# EAGLE design switch (EAGLE 8.2.2)
CNAME: Simulacare; CREVISION: 1.0.1; DESIGNER: Rinaldo; UNTITLED: Chaves Compressão
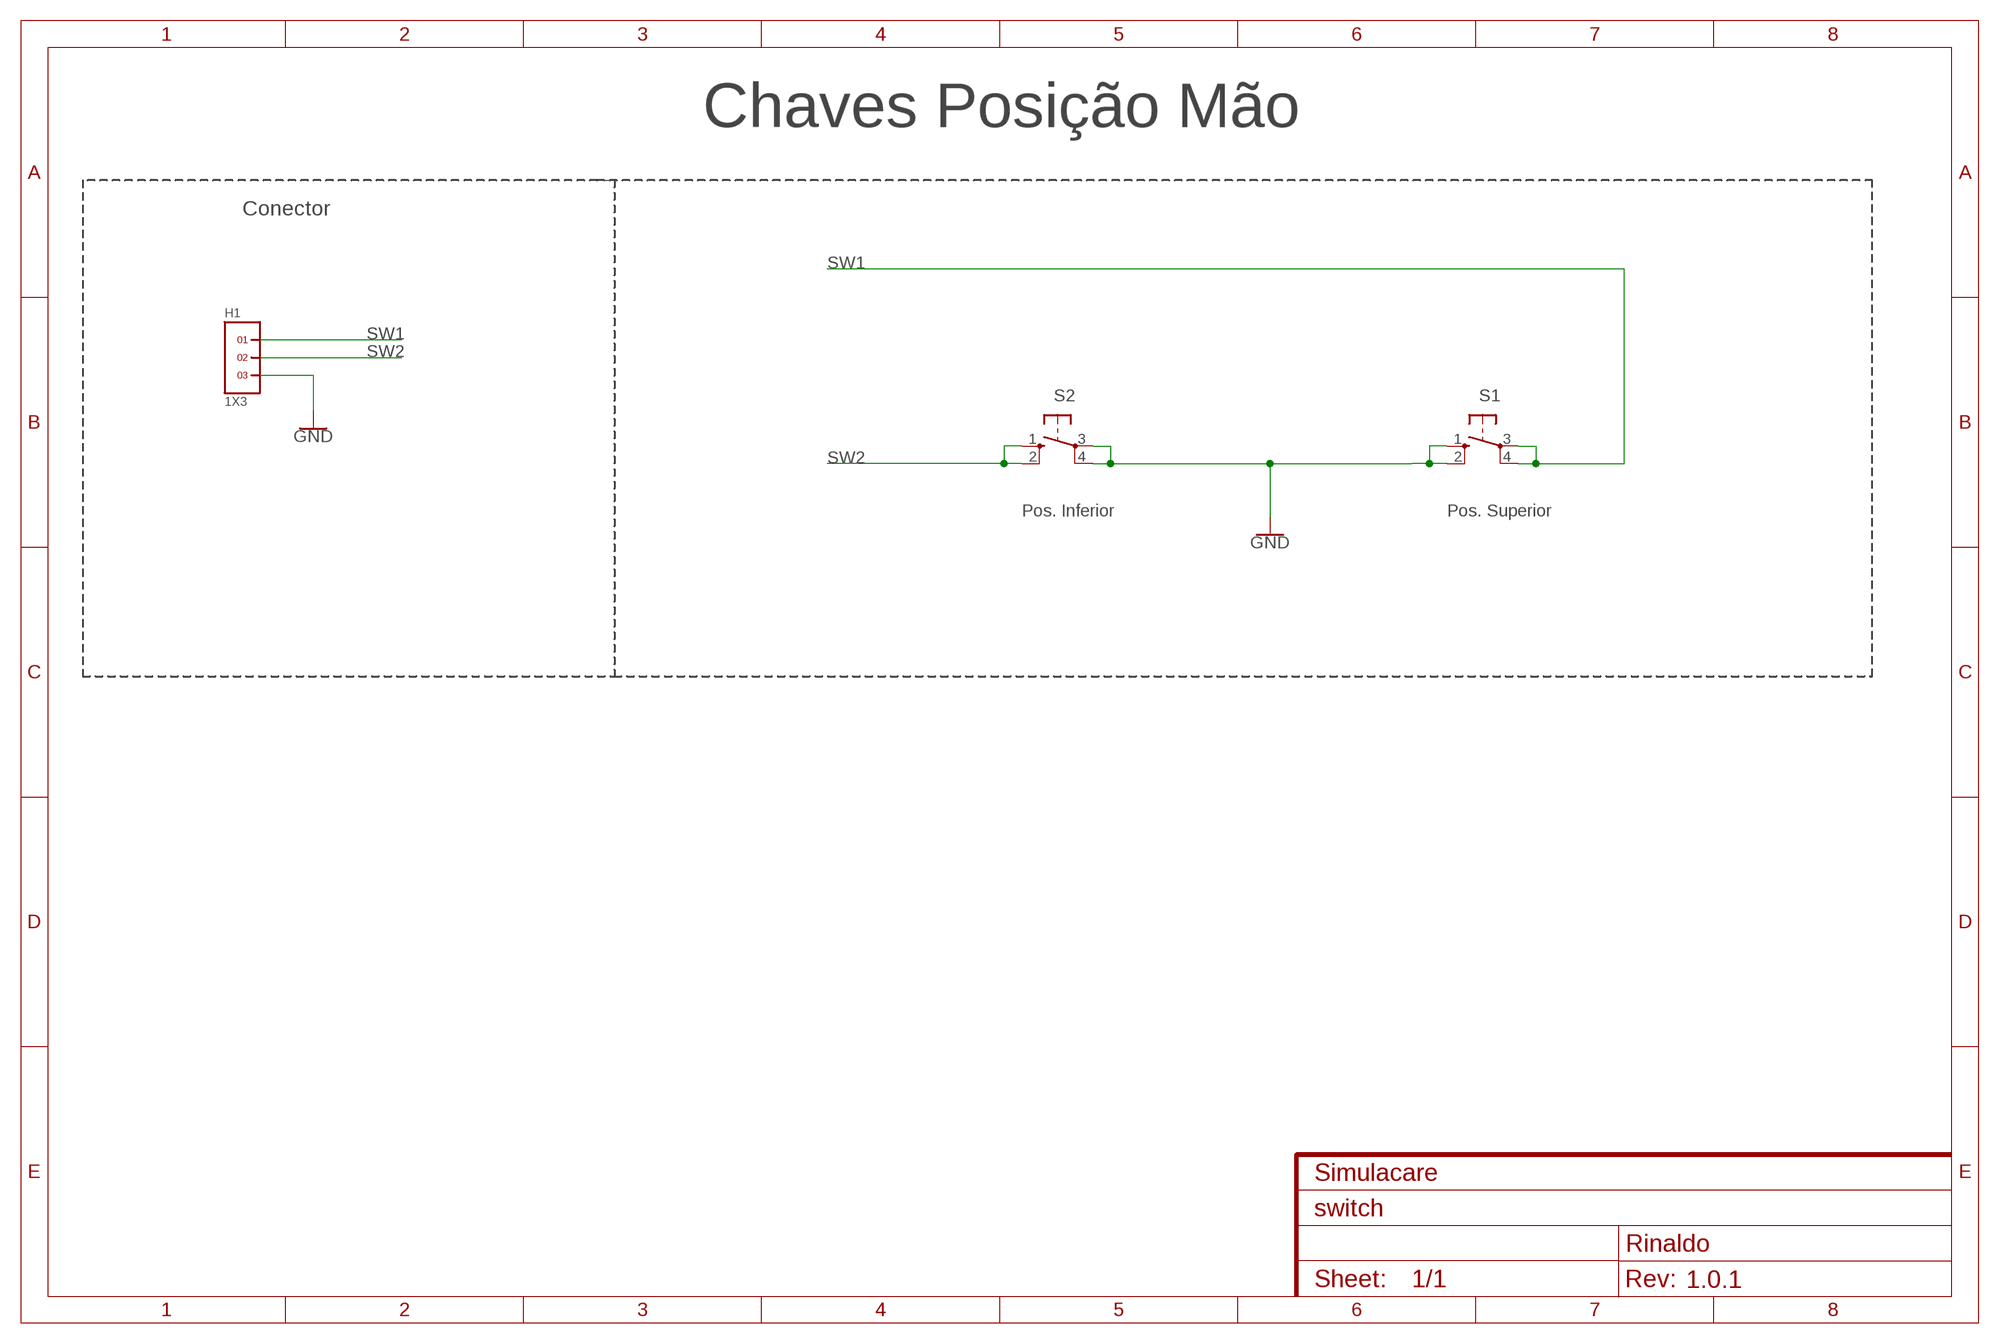
[diagram p0: schematic, sheet 1]

## Parts
H1  1X3  [1X3]
S1  40-XX  [B3F-40XX]
S2  40-XX  [B3F-40XX]

## Nets
GND: H1.3 S1.1(S) S1.2(S1) S2.3(P) S2.4(P1)
SW1: H1.1 S1.3(P) S1.4(P1)
SW2: H1.2 S2.1(S) S2.2(S1)

## Notes on the sheet
- Chaves Posição Mão
- Conector
- Pos. Inferior | Pos. Superior

## Library data of the parts
H1 = headers(.1in):1X3
S1 S2 = switch-omron:40-XX: OMRON SWITCH; MF: OMRON COMPONENTS USA; MPN: B3F-4000; OC_FARNELL: 176434; OC_NEWARK: 36K3105

## Board
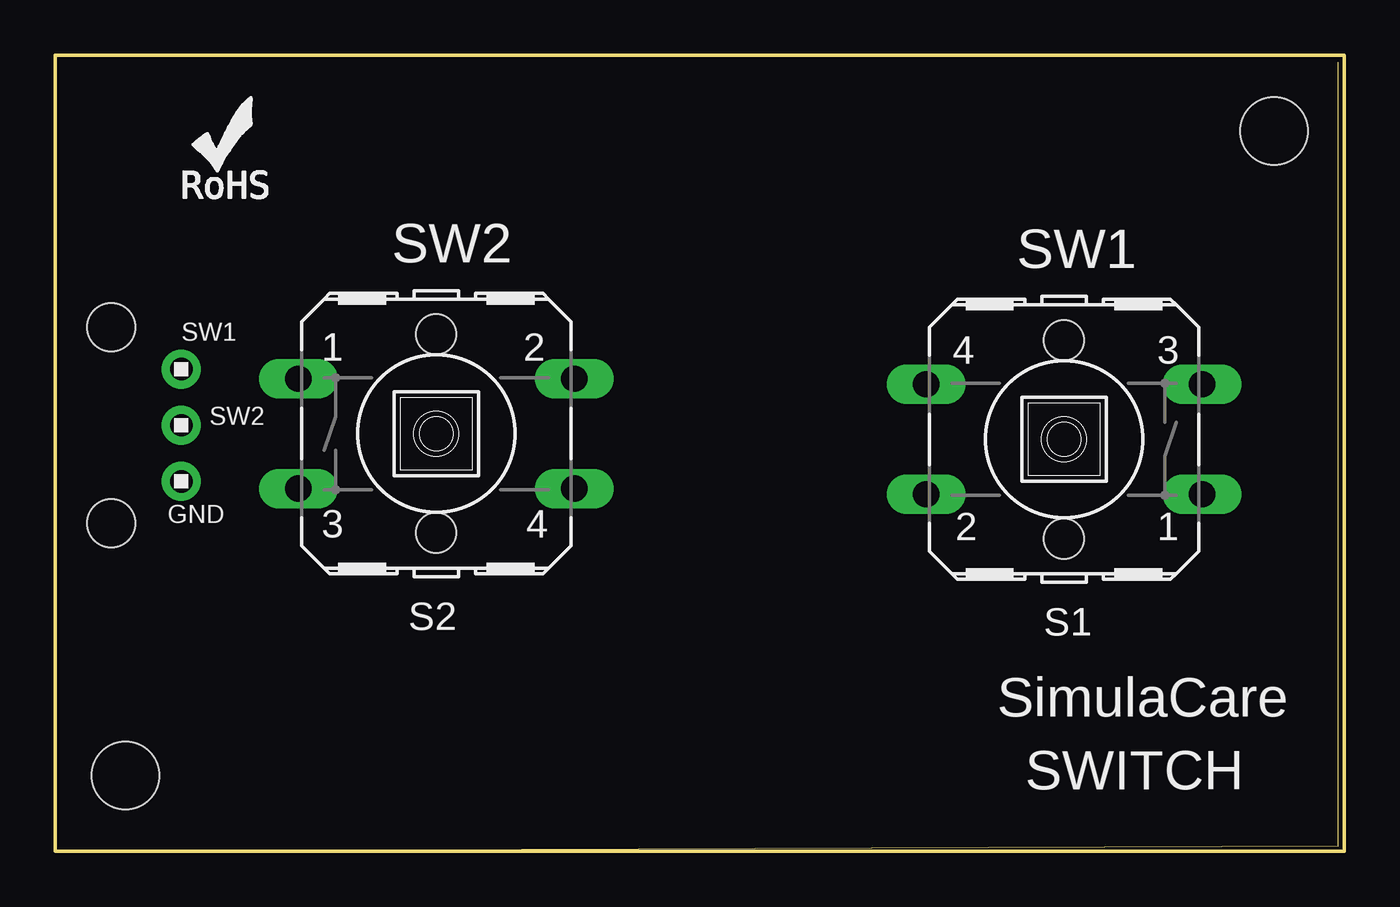
[diagram p1: board, top side]
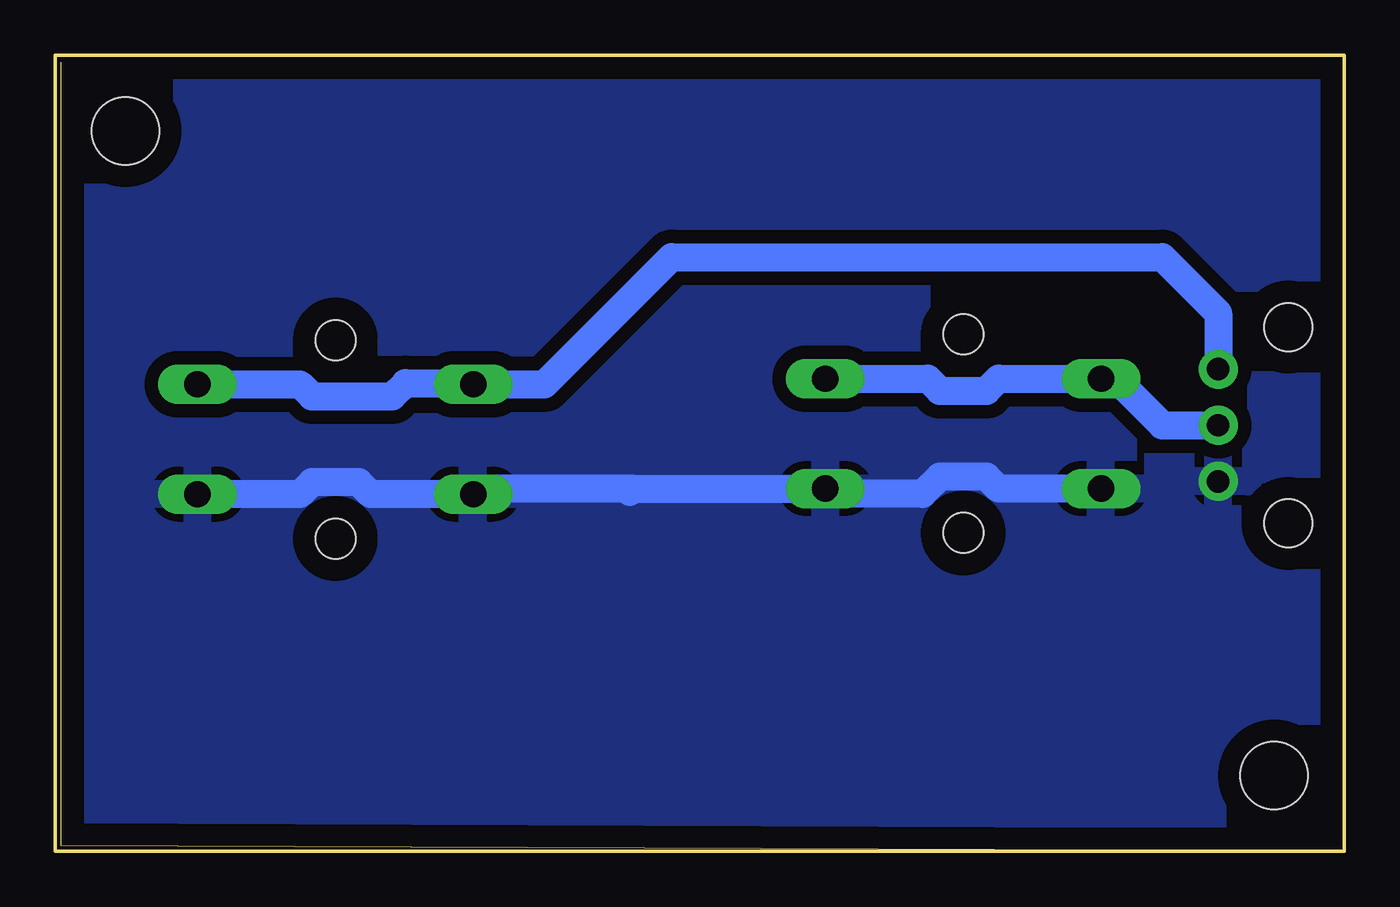
[diagram p2: board, bottom side, seen from below]

Size 58.42 x 36.07 mm. Coordinates in mm from the lower left corner, seen from the top.
Outline: 0,0 58.15,0.25 58.15,35.74
Outline: 0,0 58.42,0 58.42,0.51 58.42,36.07 0,36.07 0,0
Copper layers (1*16): Top 0.035mm / dielectric 1.5mm / Bottom 0.035mm
Design rules "default *": minimum track width 10mil, minimum drill 0.8mm, track to track 24mil, track to pad 24mil, pad to pad 24mil, via to via 24mil, smd to smd 24mil, copper to edge 40mil, drill to drill 10mil, minimum pad ring 10mil, minimum via ring 8mil, stop-mask expansion 4mil, vias tented up to drill 0mil, thermal gap 14mil
Holes 2.16 mm at 2.54,23.75 2.54,14.86
Holes 3.05 mm at 3.17,3.43 55.24,32.64

### Footprints (pad centres in the part's own frame; a part is rotated, then mirrored left to right if it is on the bottom)
1X3 = drill 1.016 pad 1.778: 1 0,0; 2 2.54,0; 3 5.08,0
B3F-40XX = drill 1.194 long: 1 -6.248,2.489; 2 6.248,2.489; 3 -6.248,-2.489; 4 6.248,-2.489 | hole 1.803: 0,-4.496; 0,4.496

### Placement (x,y rotation side)
H1  5.71,21.84 270 top
S1  45.72,18.67 180 top
S2  17.27,18.92 0 top
U$1  [ROHS_LOGO_0.18_IN]  5.59,29.46 0 top

### Tracks (layer width: path | path; a pad name or v marks a point on that pad's centre or on a via)
GND
  Bottom 1.27: S2.3 15.67,16.43 16.21,16.98 18.33,16.98 19.11,16.19 23.28,16.19 S2.4 32.24,16.43 | 32.24,16.43 39.22,16.43 S1.2 44.12,16.18 44.66,16.73 46.78,16.73 47.32,16.18 S1.1 | 32.38,16.29 32.24,16.43
  pour Bottom: 1.27,35.18 1.27,1.52 56.52,1.52 56.52,35.18
SW1
  Bottom 1.27: S1.3 47.32,21.16 46.78,20.61 43.14,20.61 42.55,21.21 39.52,21.21 S1.4 36.25,21.16 30.48,26.92 8.26,26.92 5.71,24.38 H1.1
SW2
  Bottom 1.27: S2.2 18.88,21.41 18.33,20.87 16.21,20.87 15.67,21.41 S2.1 10.36,21.41 8.26,19.3 H1.2

### Text on the board
tPlace: SW2 | SW1 | SW1 | SW2 | GND | SimulaCare | SWITCH